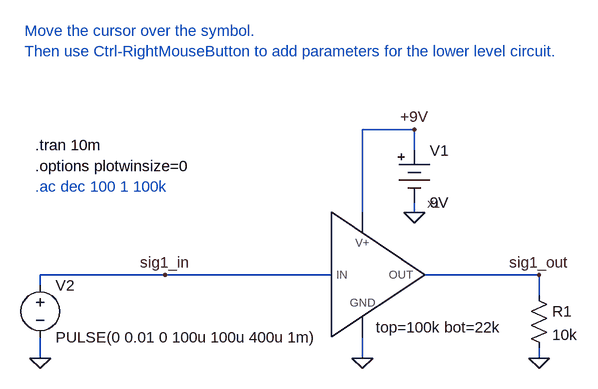
[diagram p0: schematic top_preamp.asc]
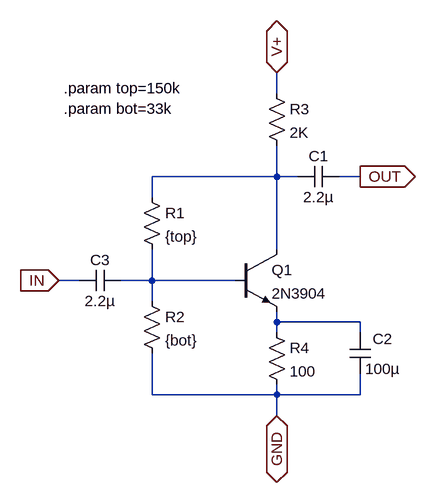
[diagram p1: sub-circuit preamp.asc]
top_preamp.asc, the LTspice schematic file:
Version 4
SHEET 1 880 680
WIRE -352 256 -352 240
WIRE -352 368 -352 336
WIRE -160 240 -352 240
WIRE 96 240 -160 240
WIRE 144 144 144 16
WIRE 144 368 144 336
WIRE 224 16 144 16
WIRE 224 48 224 16
WIRE 224 144 224 128
WIRE 416 240 240 240
WIRE 416 272 416 240
WIRE 416 368 416 352
FLAG 144 368 0
FLAG 224 144 0
FLAG 224 16 +9V
FLAG 416 368 0
FLAG -352 368 0
FLAG -160 240 sig1_in
FLAG 416 240 sig1_out
SYMBOL Misc\\battery 224 32 R0
SYMATTR InstName V1
SYMATTR Value 9V
SYMBOL preamp 144 240 R0
WINDOW 39 21 81 Left 0
SYMATTR InstName X1
SYMATTR SpiceLine top=100k bot=22k
SYMBOL res 400 256 R0
SYMATTR InstName R1
SYMATTR Value 10k
SYMBOL voltage -352 240 R0
WINDOW 123 0 0 Left 0
WINDOW 39 0 0 Left 0
SYMATTR InstName V2
SYMATTR Value PULSE(0 0.01 0 100u 100u 400u 1m)
TEXT -360 40 Left 0 !.tran 10m
TEXT -360 72 Left 0 !.options plotwinsize=0
TEXT -360 104 Left 0 ;.ac dec 100 1 100k
TEXT -376 -136 Left 0 ;Move the cursor over the symbol.\nThen use Ctrl-RightMouseButton to add parameters for the lower level circuit.

preamp.asc, the sub-circuit schematic file:
Version 4
SHEET 1 880 680
WIRE -32 256 -64 256
WIRE 80 128 80 96
WIRE 80 256 32 256
WIRE 80 256 80 208
WIRE 80 288 80 256
WIRE 80 432 80 368
WIRE 208 256 80 256
WIRE 272 -32 272 -64
WIRE 272 96 80 96
WIRE 272 96 272 48
WIRE 272 208 272 96
WIRE 272 320 272 304
WIRE 272 336 272 320
WIRE 272 432 80 432
WIRE 272 432 272 416
WIRE 272 464 272 432
WIRE 304 96 272 96
WIRE 400 96 368 96
WIRE 400 320 272 320
WIRE 400 336 400 320
WIRE 400 432 272 432
WIRE 400 432 400 400
FLAG -64 256 IN
IOPIN -64 256 In
FLAG 400 96 OUT
IOPIN 400 96 Out
FLAG 272 -64 V+
IOPIN 272 -64 BiDir
FLAG 272 464 GND
IOPIN 272 464 BiDir
SYMBOL res 64 112 R0
SYMATTR InstName R1
SYMATTR Value {top}
SYMBOL res 64 272 R0
SYMATTR InstName R2
SYMATTR Value {bot}
SYMBOL res 256 -48 R0
SYMATTR InstName R3
SYMATTR Value 2K
SYMATTR SpiceLine tol=1 pwr=0.1
SYMBOL res 256 320 R0
SYMATTR InstName R4
SYMATTR Value 100
SYMATTR SpiceLine tol=1 pwr=0.1
SYMBOL npn 208 208 R0
SYMATTR InstName Q1
SYMATTR Value 2N3904
SYMBOL cap 368 80 R90
WINDOW 0 0 32 VBottom 0
WINDOW 3 32 32 VTop 0
SYMATTR InstName C1
SYMATTR Value 2.2µ
SYMATTR SpiceLine V=25 Irms=0 Rser=0.001 MTBF=0 Lser=0 mfg="TDK" pn="C575OX7RIE106M" type="X7R" ppPkg=1
SYMBOL cap 32 240 R90
WINDOW 0 0 32 VBottom 0
WINDOW 3 32 32 VTop 0
SYMATTR InstName C3
SYMATTR Value 2.2µ
SYMATTR SpiceLine V=100 Irms=4.58 Rser=0.025 MTBF=0 Lser=0 mfg="KEMET" pn="C2225C105K1RAC" type="X7R" ppPkg=1
SYMBOL cap 416 400 R180
WINDOW 0 -19 70 Bottom 0
WINDOW 3 -19 -8 Top 0
SYMATTR InstName C2
SYMATTR Value 100µ
SYMATTR SpiceLine V=25 Irms=0 Rser=0.001 MTBF=0 Lser=0 mfg="TDK" pn="C575OX7RIE106M" type="X7R" ppPkg=1
TEXT -56 -40 Left 0 !.param top=150k\n.param bot=33k

The netlist it stands for:
* top_preamp.asc
V1 +9V 0 9V
XX1 sig1_in 0 sig1_out +9V preamp params: top=100k bot=22k
R1 sig1_out 0 10k
V2 sig1_in 0 PULSE(0 0.01 0 100u 100u 400u 1m)

* block symbol definitions
.subckt preamp IN GND OUT V+
R1 N001 N002 {top}
R2 N002 GND {bot}
R3 V+ N001 2K tol=1 pwr=0.1
R4 N003 GND 100 tol=1 pwr=0.1
Q1 N001 N002 N003 0 2N3904
C1 OUT N001 2.2µ V=25 Irms=0 Rser=0.001 MTBF=0 Lser=0 mfg="TDK" pn="C575OX7RIE106M" type="X7R" ppPkg=1
C3 N002 IN 2.2µ V=100 Irms=4.58 Rser=0.025 MTBF=0 Lser=0 mfg="KEMET" pn="C2225C105K1RAC" type="X7R" ppPkg=1
C2 GND N003 100µ V=25 Irms=0 Rser=0.001 MTBF=0 Lser=0 mfg="TDK" pn="C575OX7RIE106M" type="X7R" ppPkg=1
.param top=150k
.param bot=33k
.ends preamp

.model NPN NPN
.model PNP PNP
.lib standard.bjt
.tran 10m
.options plotwinsize=0
* .ac dec 100 1 100k
* Move the cursor over the symbol.
* Then use Ctrl-RightMouseButton to add parameters for the lower level circuit.
.backanno
.end